# EAGLE schematic SMD_Pad_Sizes (EAGLE 9.6.2)
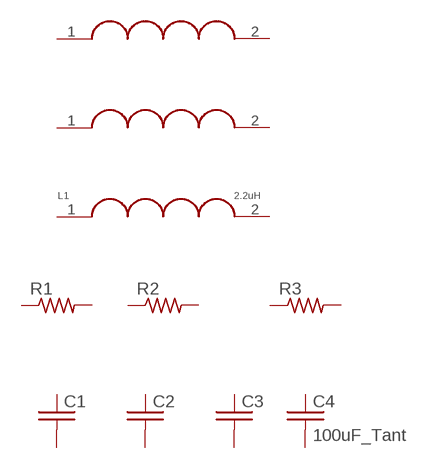
[diagram p0: schematic, sheet 1]

## Parts
C1  C_0402  [0402]
C2  C_0603  [0603]
C3  C_0805  [0805]
C4  100uF_Tant  C_1210_100UF_TANT  [C1210]
FB1  FB2_603  FB_0603_120_OHM0603  [0603]
FB2  120Ohm  FB_0805_120_OHM  [0805]
L1  2.2uH  INDUCTOR_1008_2.2_MH_1.3A  [1008]
R1  R_0402  [0402]
R2  R_0603  [0603]
R3  R_0805  [0805]
Unconnected: C1.1 C1.2 C2.1 C2.2 C3.1 C3.2 C4.1 C4.2 FB1.1 FB1.2 FB2.1 FB2.2 L1.1 L1.2 R1.1 R1.2 R2.1 R2.2 R3.1 R3.2

## Library data of the parts
C1 = 3D_MIG_Controller:C_0402
C2 = 3D_MIG_Controller:C_0603
C3 = 3D_MIG_Controller:C_0805
C4 = 3D_MIG_Controller:C_1210_100UF_TANT; PARTNO: TLJT107M010R0900
FB1 = 3D_MIG_Controller:FB_0603_120_OHM; PARTNO: BLM18PG121SN1D
FB2 = 3D_MIG_Controller:FB_0805_120_OHM; PARTNO: BLM18PG121SN1D
L1 = 3D_MIG_Controller:INDUCTOR_1008_2.2_MH_1.3A; PARTNO: LQM2HPN2R2MG0L
R1 = 3D_MIG_Controller:R_0402
R2 = 3D_MIG_Controller:R_0603
R3 = 3D_MIG_Controller:R_0805